# Altium schematic sheet 2228_Emetteur_Systeme.SchDoc
size A3; Author: Miguel Santos; Organization: ETML-ES; Address1: Avenue Recordon 1; Address2: 1004 Lausanne; Address3: Switzerland; Revision: A; SheetNumber: 2; SheetTotal: 2; Version: 1.0
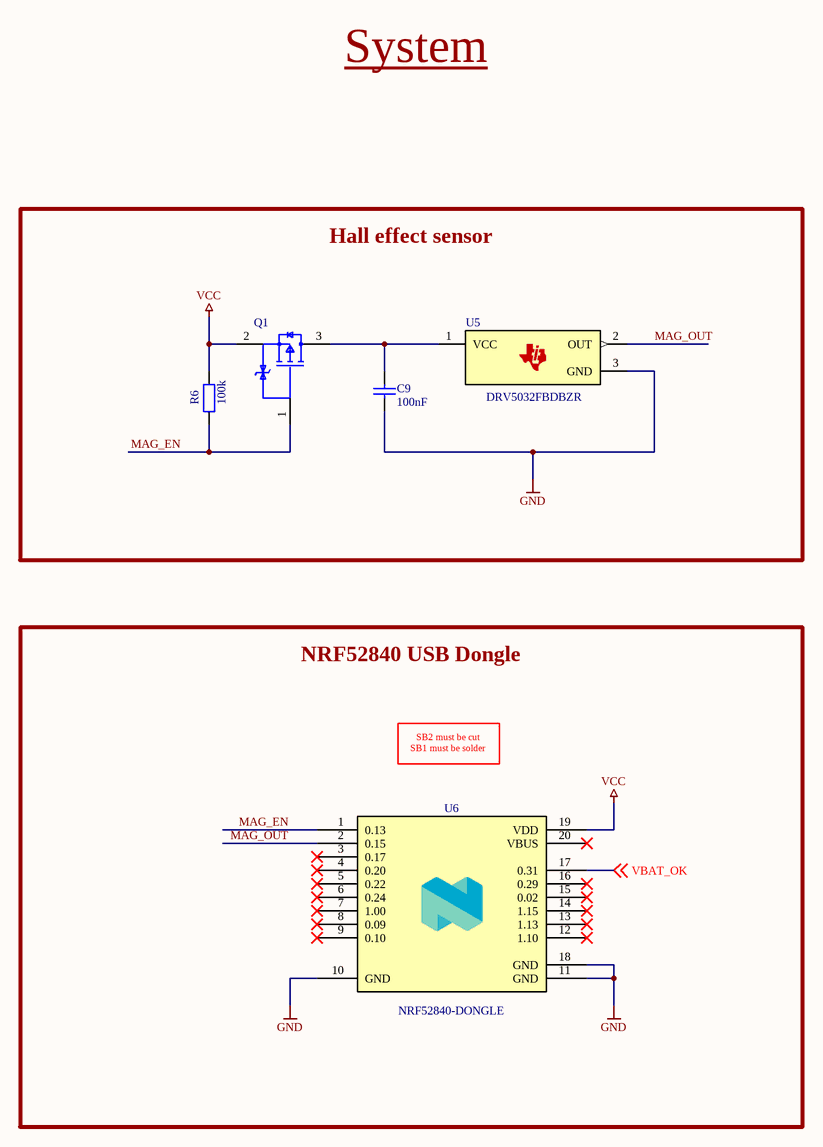
[diagram p0: 2228_Emetteur_Systeme.SchDoc]

## Parts
C9  value 100nF  [CAP_0805]  (hidden comment: CAP_SMD)
Q1  RZM001P02T2L  [FP-VMT3-MFG]  (value not drawn)
R6  value 100k  [RES_0805]  (hidden comment: RES_SMD)
U5  DRV5032FBDBZR  [SOT95P237X112-3N]
U6  NRF52840-DONGLE  [NRF52840_DONGLE]

## Blocks framed on the sheet
Hall effect sensor: C9 Q1 R6 U5
NRF52840 USB Dongle: U6

## Nets
GND: C9.1 U5.3(GND) U6.10(GND) U6.11(GND) U6.18(GND)
VCC: Q1.2(Source) R6.2 U6.19(VDD)
MAG_EN: Q1.1(Gate) R6.1 U6.1(0.13)
MAG_OUT: U5.2(OUT) U6.2(0.15)
VBAT_OK: U6.17(0.31) ; off-sheet VBAT_OK
NetC9_2: C9.2 Q1.3(Drain) U5.1(VCC)

Not connected (* = marked no-connect by the designer): U6 3(0.17)* 4(0.20)* 5(0.22)* 6(0.24)* 7(1.00)* 8(0.09)* 9(0.10)* 12(1.10)* 13(1.13)* 14(1.15)* 15(0.02)* 16(0.29)* 20(VBUS)*

## Notes on the sheet
- System
- SB2 must be cut
  SB1 must be solder
- Fichier :
- a
- Date :
- Heure :
- Version :
- Auteur :
- Modif.
- b
- c
- d
- Projet :
- No :
- Nb feuilles
- Feuille n°
- Chemin :

## Library data of the parts
C9 = CAP_SMD: Capacitor
Q1 = CMP-08982-000003-1: MOSFET P-CH 20V 0.1A VMT3; Manufacturer: Rohm; Continuous Drain Current: 100mA; Turn On Delay Time: 46ns; Depletion Mode: False; Power Dissipation: 150W; Threshold Vgs Max: -1V; Gate To Source Voltage: 10V; Threshold Vgs Min: -0.3V; Pulse Drain Current: 400mA; Number Of Channels: 1; Max Junction Temp: +150°C; Turn Off Delay Time: 325ns; Standoff Height: 0mm; Rthja Max: 833°C/W; Max Forward Diode Voltage: -1.2V; Drain To Source Resistance: 2.5Ω; Input Capacitace At Vds: 15pF @ -10V; Drain To Source Breakdown Voltage: -20V; Temperature: -55°C to +150°C; Height: 0.55mm; ComponentLink2Description: Datasheet; Temperature Range Low: -55°C; Digikey Description: MOSFET P-CH 20V 0.1A VMT3; Mouser Description: MOSFET 1.2V Drive Pch MOSFET; Temperature Range High: +150°C; ComponentLink2URL: https://www.rohm.com/datasheet/RZM001P02/rzm001p02t2l-e; Category: Trans; Octopart: https://octopart.com/rzm001p02t2l-rohm-29677415; Automotive: No; Device Class L3: MOSFETs; Package: VMT3; Device Class L2: Transistors; RoHS: TRUE; Lead Free: Yes; Number Of P Channels: 1; Manufacturer Part Number: RZM001P02T2L; Drain To Source Voltage: -20V; Device Class L1: Discrete Semiconductors
U5 = DRV5032FBDBZR: Manufacturer: Texas Instruments; Manufacturer_Number: DRV5032FBDBZR; Supplier 1: Digi-Key; Supplier Part Number 1: 296-47323-1-ND
U6 = NRF52840-DONGLE: Manufacturer: Nordic Semiconductor; Manufacturer_Number: NRF52840-DONGLE
R6 = RES_SMD: Manufacturer: *; Manufacturer_Number: *